# Altium schematic sheet connectors.SchDoc: foxBMS BMS-Slave 12-Cell
size A3; DocumentNumber: 4; SheetNumber: 4; SheetTotal: 21; AUTHOR: Fraunhofer IISB foxBMS Team; SheetDescription: Connectors
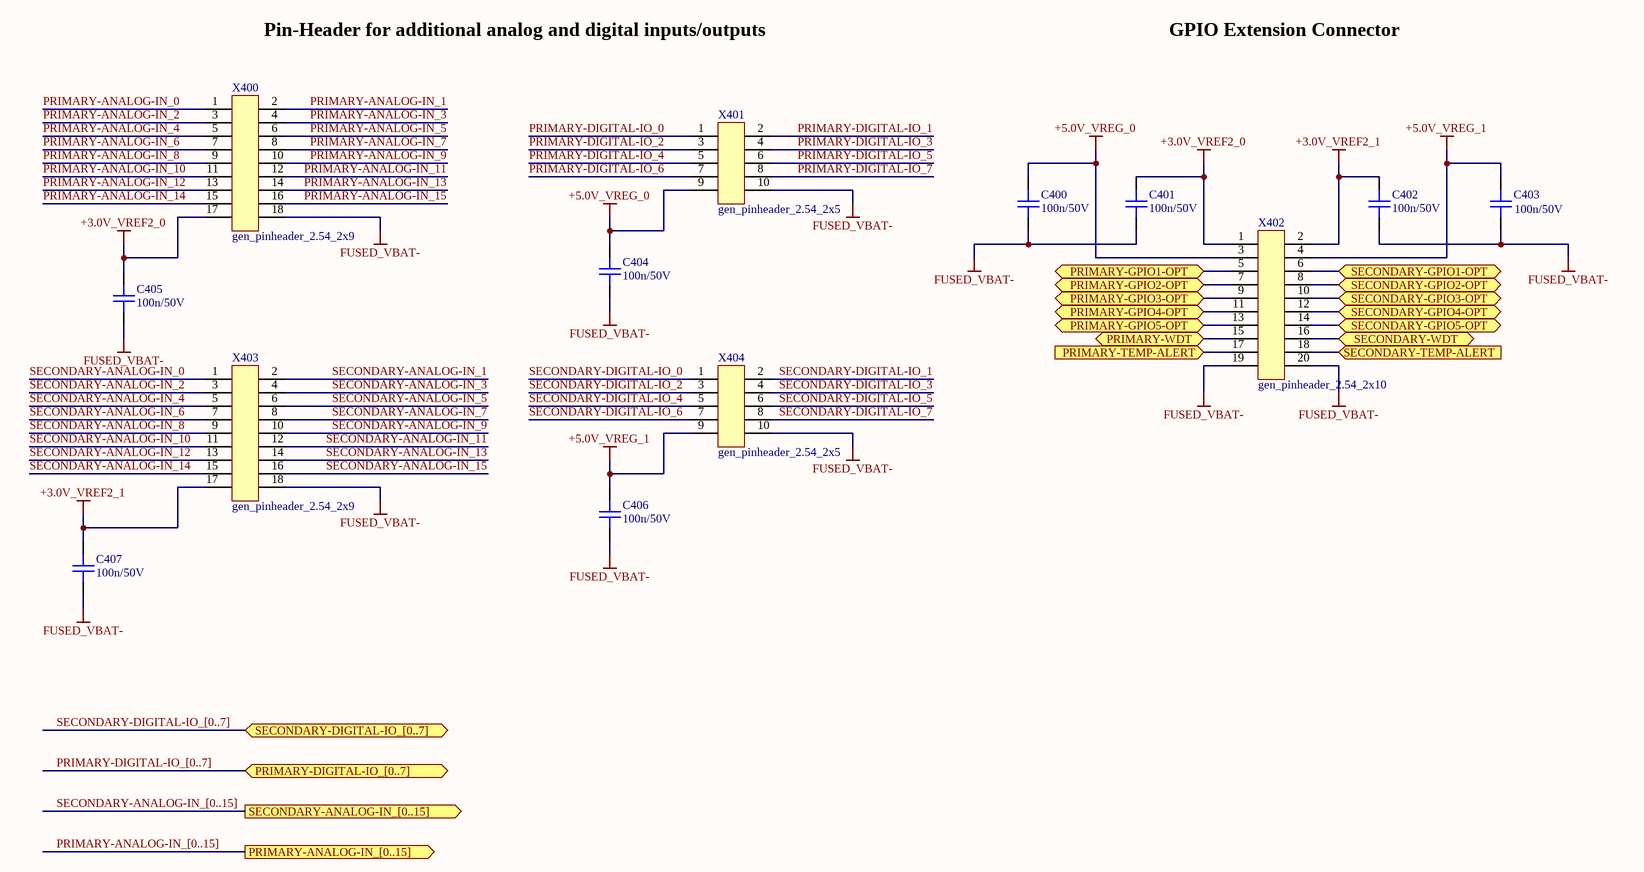
[diagram p0: connectors.SchDoc]

## Parts
C400  100n/50V  [CAPC1608X08N]
C401  100n/50V  [CAPC1608X08N]
C402  100n/50V  [CAPC1608X08N]
C403  100n/50V  [CAPC1608X08N]
C404  100n/50V  [CAPC1608X08N]
C405  100n/50V  [CAPC1608X08N]
C406  100n/50V  [CAPC1608X08N]
C407  100n/50V  [CAPC1608X08N]
X400  gen_pinheader_2.54_2x9  [Pinheader_2.54_2x9]
X401  gen_pinheader_2.54_2x5  [Pinheader_2.54_2x5]
X402  gen_pinheader_2.54_2x10  [Pinheader_2.54_2x10]
X403  gen_pinheader_2.54_2x9  [Pinheader_2.54_2x9]
X404  gen_pinheader_2.54_2x5  [Pinheader_2.54_2x5]

## Ports
PRIMARY-ANALOG-IN_[0..15] (out), PRIMARY-DIGITAL-IO_[0..7] (bidir), PRIMARY-GPIO1-OPT (bidir), PRIMARY-GPIO2-OPT (bidir), PRIMARY-GPIO3-OPT (bidir), PRIMARY-GPIO4-OPT (bidir), PRIMARY-GPIO5-OPT (bidir), PRIMARY-TEMP-ALERT (in), PRIMARY-WDT (bidir), SECONDARY-ANALOG-IN_[0..15] (out), SECONDARY-DIGITAL-IO_[0..7] (bidir), SECONDARY-GPIO1-OPT (bidir), SECONDARY-GPIO2-OPT (bidir), SECONDARY-GPIO3-OPT (bidir), SECONDARY-GPIO4-OPT (bidir), SECONDARY-GPIO5-OPT (bidir), SECONDARY-TEMP-ALERT (in), SECONDARY-WDT (bidir)

## Nets
+3.0V_VREF2_0: C401.2 C405.2 X400.17 X402.1
+3.0V_VREF2_1: C402.2 C407.2 X402.2 X403.17
+5.0V_VREG_0: C400.2 C404.2 X401.9 X402.3
+5.0V_VREG_1: C403.2 C406.2 X402.4 X404.9
FUSED_VBAT-: C400.1 C401.1 C402.1 C403.1 C404.1 C405.1 C406.1 C407.1 X400.18 X401.10 X402.19 X402.20 X403.18 X404.10
PRIMARY-ANALOG-IN_0: X400.1
PRIMARY-ANALOG-IN_1: X400.2
PRIMARY-ANALOG-IN_2: X400.3
PRIMARY-ANALOG-IN_3: X400.4
PRIMARY-ANALOG-IN_4: X400.5
PRIMARY-ANALOG-IN_5: X400.6
PRIMARY-ANALOG-IN_6: X400.7
PRIMARY-ANALOG-IN_7: X400.8
PRIMARY-ANALOG-IN_8: X400.9
PRIMARY-ANALOG-IN_9: X400.10
PRIMARY-ANALOG-IN_10: X400.11
PRIMARY-ANALOG-IN_11: X400.12
PRIMARY-ANALOG-IN_12: X400.13
PRIMARY-ANALOG-IN_13: X400.14
PRIMARY-ANALOG-IN_14: X400.15
PRIMARY-ANALOG-IN_15: X400.16
PRIMARY-DIGITAL-IO_0: X401.1
PRIMARY-DIGITAL-IO_1: X401.2
PRIMARY-DIGITAL-IO_2: X401.3
PRIMARY-DIGITAL-IO_3: X401.4
PRIMARY-DIGITAL-IO_4: X401.5
PRIMARY-DIGITAL-IO_5: X401.6
PRIMARY-DIGITAL-IO_6: X401.7
PRIMARY-DIGITAL-IO_7: X401.8
PRIMARY-GPIO1-OPT: X402.5 ; port PRIMARY-GPIO1-OPT
PRIMARY-GPIO2-OPT: X402.7 ; port PRIMARY-GPIO2-OPT
PRIMARY-GPIO3-OPT: X402.9 ; port PRIMARY-GPIO3-OPT
PRIMARY-GPIO4-OPT: X402.11 ; port PRIMARY-GPIO4-OPT
PRIMARY-GPIO5-OPT: X402.13 ; port PRIMARY-GPIO5-OPT
PRIMARY-TEMP-ALERT: X402.17 ; port PRIMARY-TEMP-ALERT
PRIMARY-WDT: X402.15 ; port PRIMARY-WDT
SECONDARY-ANALOG-IN_0: X403.1
SECONDARY-ANALOG-IN_1: X403.2
SECONDARY-ANALOG-IN_2: X403.3
SECONDARY-ANALOG-IN_3: X403.4
SECONDARY-ANALOG-IN_4: X403.5
SECONDARY-ANALOG-IN_5: X403.6
SECONDARY-ANALOG-IN_6: X403.7
SECONDARY-ANALOG-IN_7: X403.8
SECONDARY-ANALOG-IN_8: X403.9
SECONDARY-ANALOG-IN_9: X403.10
SECONDARY-ANALOG-IN_10: X403.11
SECONDARY-ANALOG-IN_11: X403.12
SECONDARY-ANALOG-IN_12: X403.13
SECONDARY-ANALOG-IN_13: X403.14
SECONDARY-ANALOG-IN_14: X403.15
SECONDARY-ANALOG-IN_15: X403.16
SECONDARY-DIGITAL-IO_0: X404.1
SECONDARY-DIGITAL-IO_1: X404.2
SECONDARY-DIGITAL-IO_2: X404.3
SECONDARY-DIGITAL-IO_3: X404.4
SECONDARY-DIGITAL-IO_4: X404.5
SECONDARY-DIGITAL-IO_5: X404.6
SECONDARY-DIGITAL-IO_6: X404.7
SECONDARY-DIGITAL-IO_7: X404.8
SECONDARY-GPIO1-OPT: X402.6 ; port SECONDARY-GPIO1-OPT
SECONDARY-GPIO2-OPT: X402.8 ; port SECONDARY-GPIO2-OPT
SECONDARY-GPIO3-OPT: X402.10 ; port SECONDARY-GPIO3-OPT
SECONDARY-GPIO4-OPT: X402.12 ; port SECONDARY-GPIO4-OPT
SECONDARY-GPIO5-OPT: X402.14 ; port SECONDARY-GPIO5-OPT
SECONDARY-TEMP-ALERT: X402.18 ; port SECONDARY-TEMP-ALERT
SECONDARY-WDT: X402.16 ; port SECONDARY-WDT

## Buses and harness runs
bus PRIMARY-ANALOG-IN_[0..15] = port PRIMARY-ANALOG-IN_[0..15]
bus PRIMARY-DIGITAL-IO_[0..7] = port PRIMARY-DIGITAL-IO_[0..7]
bus SECONDARY-ANALOG-IN_[0..15] = port SECONDARY-ANALOG-IN_[0..15]
bus SECONDARY-DIGITAL-IO_[0..7] = port SECONDARY-DIGITAL-IO_[0..7]

## Notes on the sheet
- Pin-Header for additional analog and digital inputs/outputs
- GPIO Extension Connector
- Fraunhofer IISB
- Schottkystr. 10
- developed by:
- 91058 Erlangen
- Germany
- Author
- Project
- License
- Description
- File
- Version
- Release Date
- Sheet
- www.foxbms.org
- www.iisb.fraunhofer.de
- foxBMS Team
- /

## Library data of the parts
C400-C407 = gen_C_ceramic_100n_50V_X7R_0603: MLCC; Capacitance: 100n; Rated Voltage: 50V; Dielectric: X7R; Case EIA: 0603; Case Metric: 1608; PnP Package: C_0603_10; PnP Value: 100n/50V/X7R; PnP equipped: x; Automotive Qualified: False; Part Number: gen_C_ceramic_100n_50V_X7R_0603; Supplier 1: Farnell; Supplier Part Number 1: 2525267; Supplier 2: Digikey; Supplier Part Number 2: 490-6049-1-ND
X400 X403 = gen_pinheader_2.54_2x9: Standard Pinheader, THD, gerade, 2.54mm, 2-reihig; Circuits: 18; Rated Voltage: 250V; Rated Current: 3A; Automotive Qualified: False; Part Number: gen_pinheader_2.54_2x9; Part Name: PinHeader; Operating Temperature: −40 °C - +105 °C; Supplier 1: Farnell; Supplier Part Number 1: 2025256
X401 X404 = gen_pinheader_2.54_2x5: Standard Pinheader, THD, gerade, 2.54mm, 2-reihig; Circuits: 10; Rated Voltage: 250V; Rated Current: 3A; Automotive Qualified: False; Part Number: gen_pinheader_2.54_2x5; Part Name: PinHeader; Operating Temperature: −40 °C - +105 °C; Supplier 1: Farnell; Supplier Part Number 1: 2578720
X402 = gen_pinheader_2.54_2x10: Standard Pinheader, THD, gerade, 2.54mm, 2-reihig; Circuits: 20; Rated Voltage: 250V; Rated Current: 3A; Automotive Qualified: False; Part Number: gen_pinheader_2.54_2x10; Part Name: PinHeader; Operating Temperature: −40 °C - +105 °C; Supplier 1: Farnell; Supplier Part Number 1: 2025257